# EAGLE design esp12-prog-jig-V1.2 (EAGLE 9.6.2)
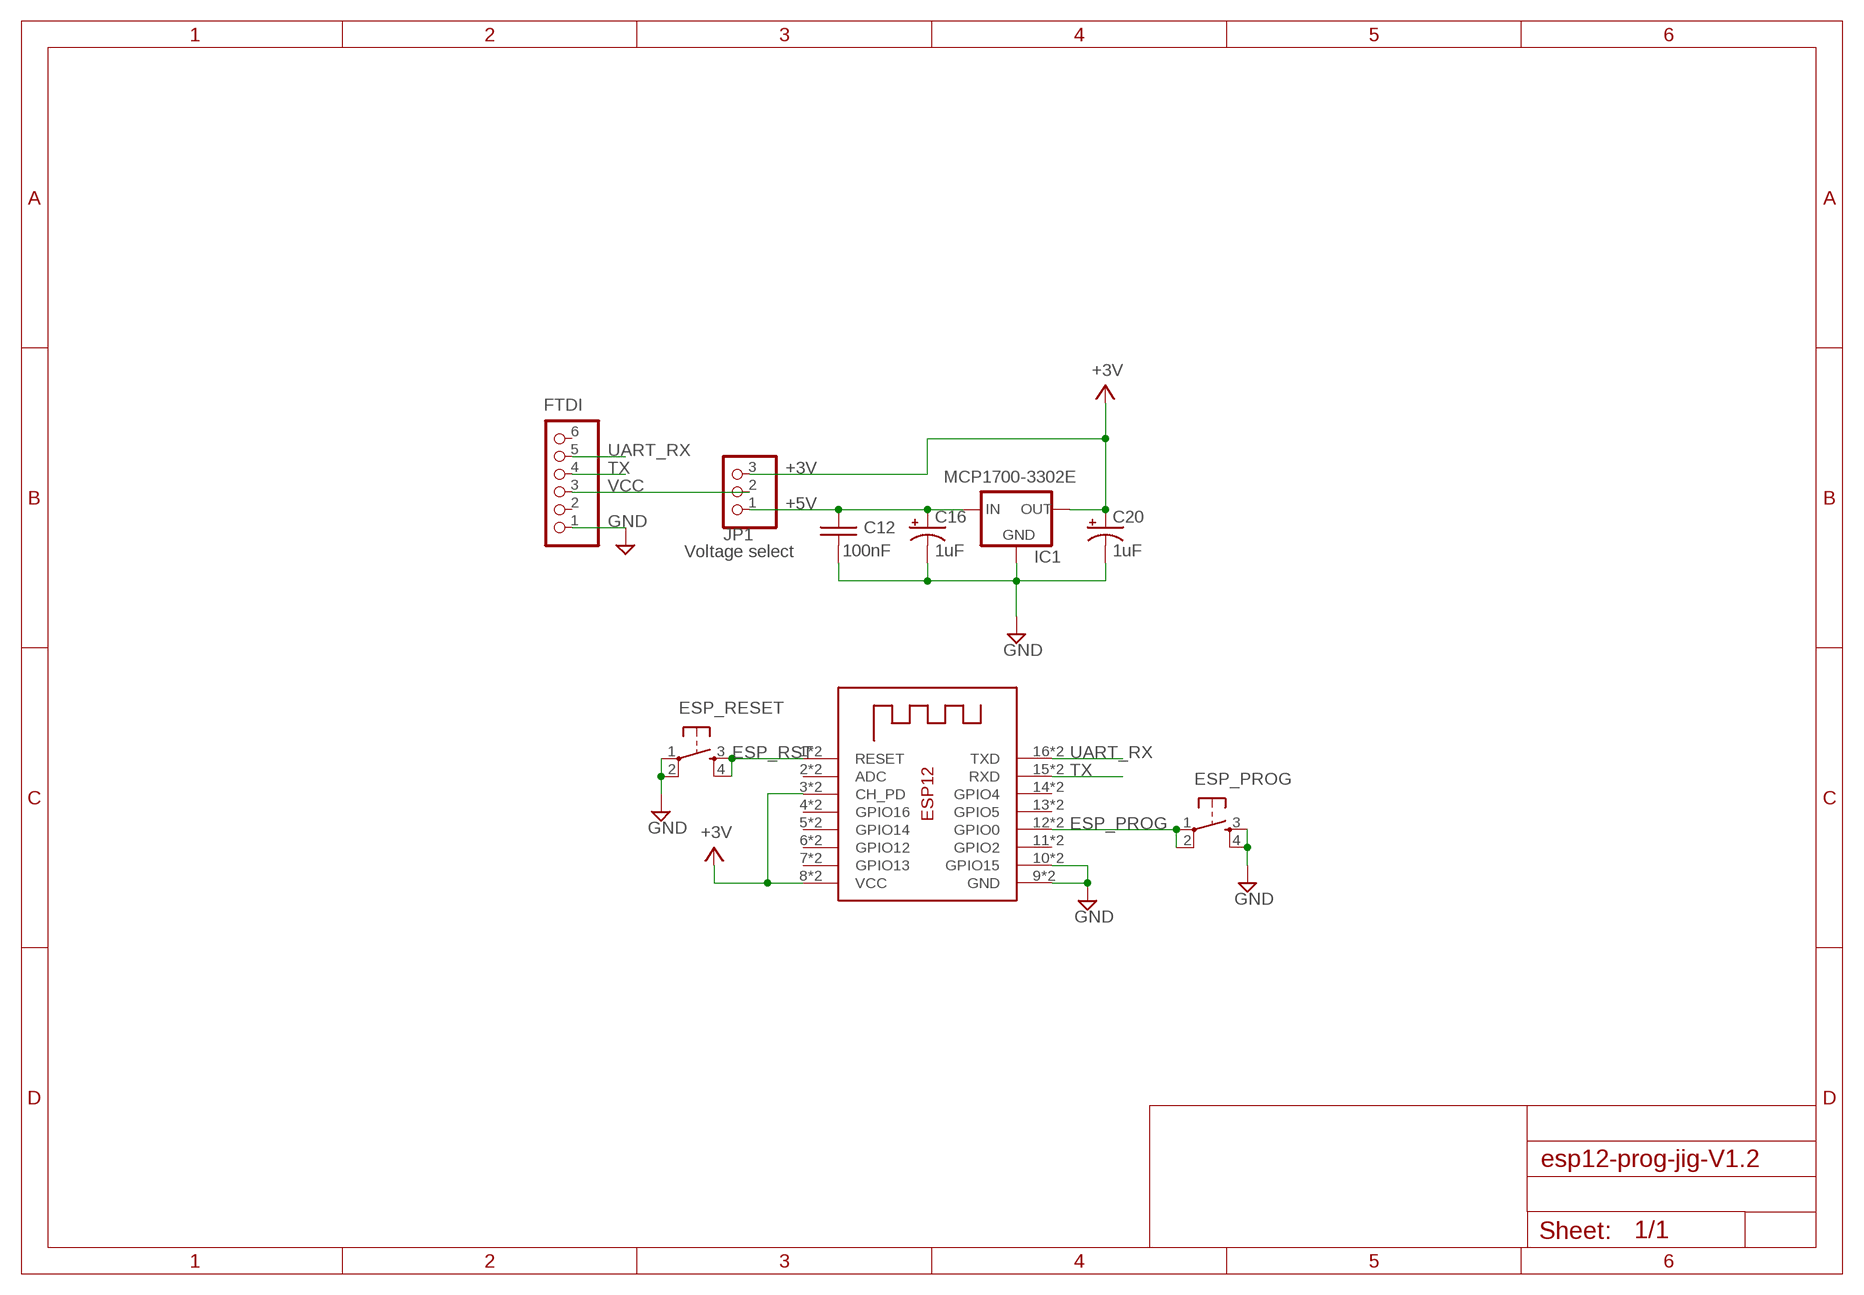
[diagram p0: schematic, sheet 1]

## Parts
C12  100nF  UZEBOX_CAP_C025  [UZEBOX_CAP_C025]
C16  1uF  UZEBOX_CAP_E25X6  [UZEBOX_CAP_E5X6]
C20  1uF  UZEBOX_CAP_E25X6  [UZEBOX_CAP_E5X6]
ESP_PROG  UZEBOX_TACTILE_SWITCHPTH  [TACTILE-PTH]
ESP_RESET  UZEBOX_TACTILE_SWITCHPTH  [TACTILE-PTH]
FTDI  PINHD-1X6/90  [1X06/90]
IC1  MCP1700-3302E  ADAFRUIT_MCP1700INLINE  [ADAFRUIT_TO92-INLINE]
JP1  Voltage select  PINHD-1X3  [1X03]
X1  ESP8266-12F  UZEBOX_ESP-12TROUGH_HOLE  [UZEBOX_ESP-12_TH]

## Nets
+3V: C20.+ IC1.3(OUT) JP1.3 X1.3(CH_PD) X1.8(VCC) X1.P$3(CH_PD) X1.P$8(VCC)
+5V: C12.1 C16.+ IC1.2(IN) JP1.1
ESP_PROG: ESP_PROG.1 ESP_PROG.2 X1.12(GPIO0) X1.P$12(GPIO0)
ESP_RST: ESP_RESET.3 ESP_RESET.4 X1.1(RESET) X1.P$1(RESET)
GND: C12.2 C16.- C20.- ESP_PROG.3 ESP_PROG.4 ESP_RESET.1 ESP_RESET.2 FTDI.1 IC1.1(GND) X1.9(GND) X1.10(GPIO15) X1.P$9(GND) X1.P$10(GPIO15)
TX: FTDI.4 X1.15(RXD) X1.P$15(RXD)
UART_RX: FTDI.5 X1.16(TXD) X1.P$16(TXD)
VCC: FTDI.3 JP1.2
Unconnected: FTDI.2 FTDI.6 X1.2(ADC) X1.4(GPIO16) X1.5(GPIO14) X1.6(GPIO12) X1.7(GPIO13) X1.11(GPIO2) X1.13(GPIO5) X1.14(GPIO4) X1.P$2(ADC) X1.P$4(GPIO16) X1.P$5(GPIO14) X1.P$6(GPIO12) X1.P$7(GPIO13) X1.P$11(GPIO2) X1.P$13(GPIO5) X1.P$14(GPIO4)

## Library data of the parts
C12 = Uzebox Portable V2:UZEBOX_CAP_C025
C16 C20 = Uzebox Portable V2:UZEBOX_CAP_E2
ESP_PROG ESP_RESET = uzebox:UZEBOX_TACTILE_SWITCH: Momentary Switch Button commonly used for reset or general input. Spark Fun Electronics SKU : COM-00097
FTDI = Uzebox Portable V2:PINHD-1X6: PIN HEADER
IC1 = Uzebox Portable V2:ADAFRUIT_MCP1700: VOLTAGE REGULATOR; DPN: MCP1700-3302E/TO-ND
JP1 = pinhead:PINHD-1X3: PIN HEADER
X1 = Uzebox Portable V2:UZEBOX_ESP-12

## Net classes
0 *: width 0.254 mm, clearance 0.254 mm

## Board
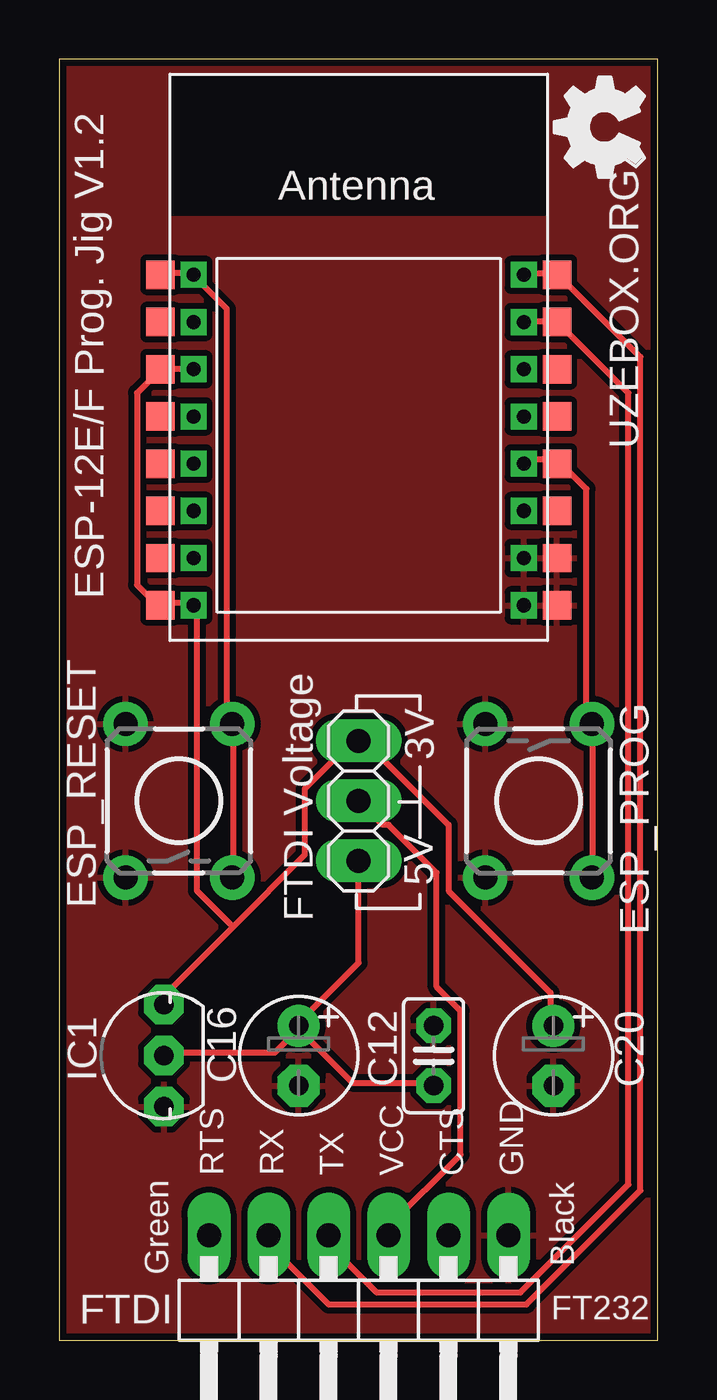
[diagram p1: board, top side]
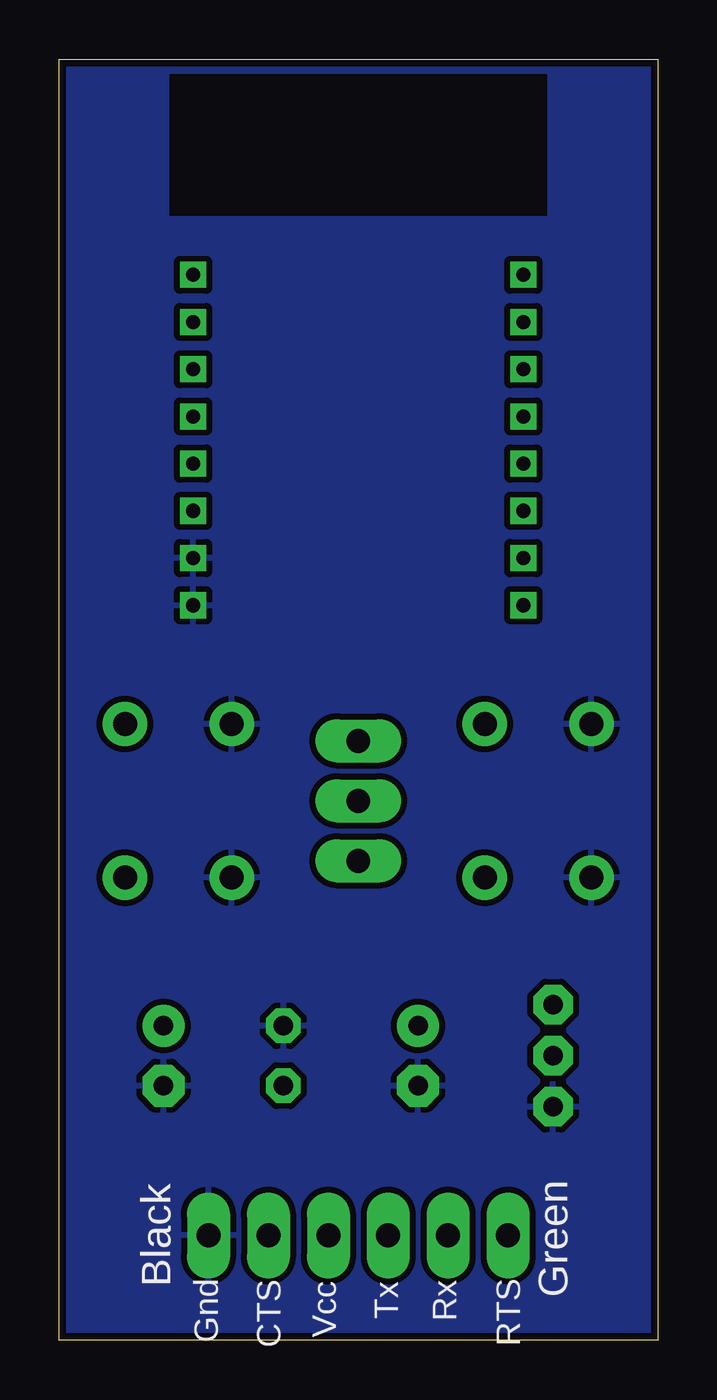
[diagram p2: board, bottom side, seen from below]

Size 25.38 x 54.28 mm. Coordinates in mm from the lower left corner, seen from the top.
Outline: 0,0 25.38,0 25.38,54.28 0,54.28 0,0
Copper layers (1*16): Top 0.035mm / dielectric 1.6mm / Bottom 0.035mm
Design rules "jlcpcb-2layers-2024 *": minimum track width 8mil, minimum drill 0.3mm, track to track 8mil, track to pad 8mil, pad to pad 8mil, via to via 8mil, smd to smd 4mil, copper to edge 0.3mm, drill to drill 0.5mm, minimum pad ring 10mil, minimum via ring 10mil, stop-mask expansion 4mil, vias tented up to drill 0mil, thermal gap 10mil

### Footprints (pad centres in the part's own frame; a part is rotated, then mirrored left to right if it is on the bottom)
UZEBOX_CAP_C025 = drill 0.813 octagon: 1 -1.27,0; 2 1.27,0
UZEBOX_CAP_E5X6 = drill 0.813 pad 1.778: + -1.27,0 | drill 0.813 pad 1.778 octagon: - 1.27,0
TACTILE-PTH = drill 1.016 pad 1.88: 1 -3.251,2.261; 2 3.251,2.261; 3 -3.251,-2.261; 4 3.251,-2.261
1X06/90 = drill 1.016 long: 1 -6.35,-3.81; 2 -3.81,-3.81; 3 -1.27,-3.81; 4 1.27,-3.81; 5 3.81,-3.81; 6 6.35,-3.81
ADAFRUIT_TO92-INLINE = drill 0.813 pad 1.676 octagon: 1 -2.159,0; 2 0,0; 3 2.159,0
1X03 = drill 1.016 long: 1 -2.54,0; 2 0,0; 3 2.54,0
UZEBOX_ESP-12_TH = smd 1.2 x 1.2: 1 -8.4,4.5; 2 -8.4,2.5; 3 -8.4,0.5; 4 -8.4,-1.5; 5 -8.4,-3.5; 6 -8.4,-5.5; 8 -8.4,-9.5; 9 8.4,-9.5; 10 8.4,-7.5; 11 8.4,-5.5; 12 8.4,-3.5; 13 8.4,-1.5; 14 8.4,0.5; 15 8.4,2.5; 16 8.4,4.5 | smd 1.22 x 1.2: 7 -8.4,-7.5 | drill 0.6 square: P$1 -7,4.5; P$2 -7,2.5; P$3 -7,0.5; P$4 -7,-1.5; P$5 -7,-3.5; P$6 -7,-5.5; P$7 -7,-7.5; P$8 -7,-9.5; P$9 7,-9.5; P$10 7,-7.5; P$11 7,-5.5; P$12 7,-3.5; P$13 7,-1.5; P$14 7,0.5; P$15 7,2.5; P$16 7,4.5

### Placement (x,y rotation side)
C12  15.88,12.06 90 top
C16  10.16,12.06 270 top
C20  20.95,12.06 270 top
ESP_PROG  20.32,22.86 270 top
ESP_RESET  5.08,22.86 90 top
FTDI  12.7,0.64 180 top
IC1  4.45,12.06 90 top
JP1  12.7,22.86 90 top
U$1  [OSHW_FILLX150_NOTEXT]  24.8,49.27 90 top
X1  12.7,40.64 0 top

### Tracks (layer width: path | path; a pad name or v marks a point on that pad's centre or on a via)
+3V
  Top 0.254: X1.P$3 5.59,41.15 4.32,41.15 X1.3 4.06,40.89 3.3,40.13 3.3,32 4.06,31.24 X1.8 4.32,31.24 5.59,31.24 X1.P$8 5.84,30.99 5.84,19.05 7.37,17.53 | 7.37,17.53 10.41,20.57 10.41,23.37 12.45,25.4 JP1.3 12.95,25.4 16.51,21.84 16.51,19.05 20.83,14.73 20.83,13.46 C20.+ | 7.37,17.53 4.57,14.73 4.57,14.22 IC1.3
+5V
  Top 0.254: 10.16,13.21 12.45,10.92 15.75,10.92 C12.1 | 10.16,13.21 9.14,12.19 4.57,12.19 IC1.2 | 10.16,13.21 C16.+ 10.16,13.46 12.7,16 JP1.1
ESP_PROG
  Top 0.254: X1.P$12 19.81,37.34 21.08,37.34 X1.12 21.34,37.08 22.35,36.07 22.35,26.16 ESP_PROG.1 22.61,25.91 22.61,19.81 ESP_PROG.2
ESP_RST
  Top 0.254: X1.1 4.32,45.21 5.59,45.21 X1.P$1 5.84,44.96 7.11,43.69 7.11,26.16 ESP_RESET.4 7.37,25.91 7.37,19.81 ESP_RESET.3
GND
  pour Top: 0,54.61 25.4,54.61 25.4,0 0,0
  pour Bottom: 0,54.61 25.4,54.61 25.4,0 0,0
TX
  Top 0.254: X1.P$15 19.81,43.18 21.08,43.18 X1.15 21.34,42.93 24.13,40.13 24.13,6.6 19.56,2.03 13.46,2.03 11.43,4.06 FTDI.4
UART_RX
  Top 0.254: X1.P$16 19.81,45.21 21.08,45.21 X1.16 21.34,44.96 24.64,41.66 24.64,6.35 19.81,1.52 11.43,1.52 8.89,4.06 FTDI.5
VCC
  Top 0.254: JP1.2 13.72,21.84 13.97,21.84 16,19.81 16,14.99 17.02,13.97 17.02,7.87 13.97,4.83 FTDI.3

### Text on the board
tNames: UZEBOX.ORG | ESP-12E/F Prog. Jig V1.2 | 3V | 5V | FTDI Voltage | Green | RTS | RX | TX | VCC | CTS | GND | Black | FT232
bNames: RTS | Rx | Tx | Vcc | CTS | Gnd | Green | Black